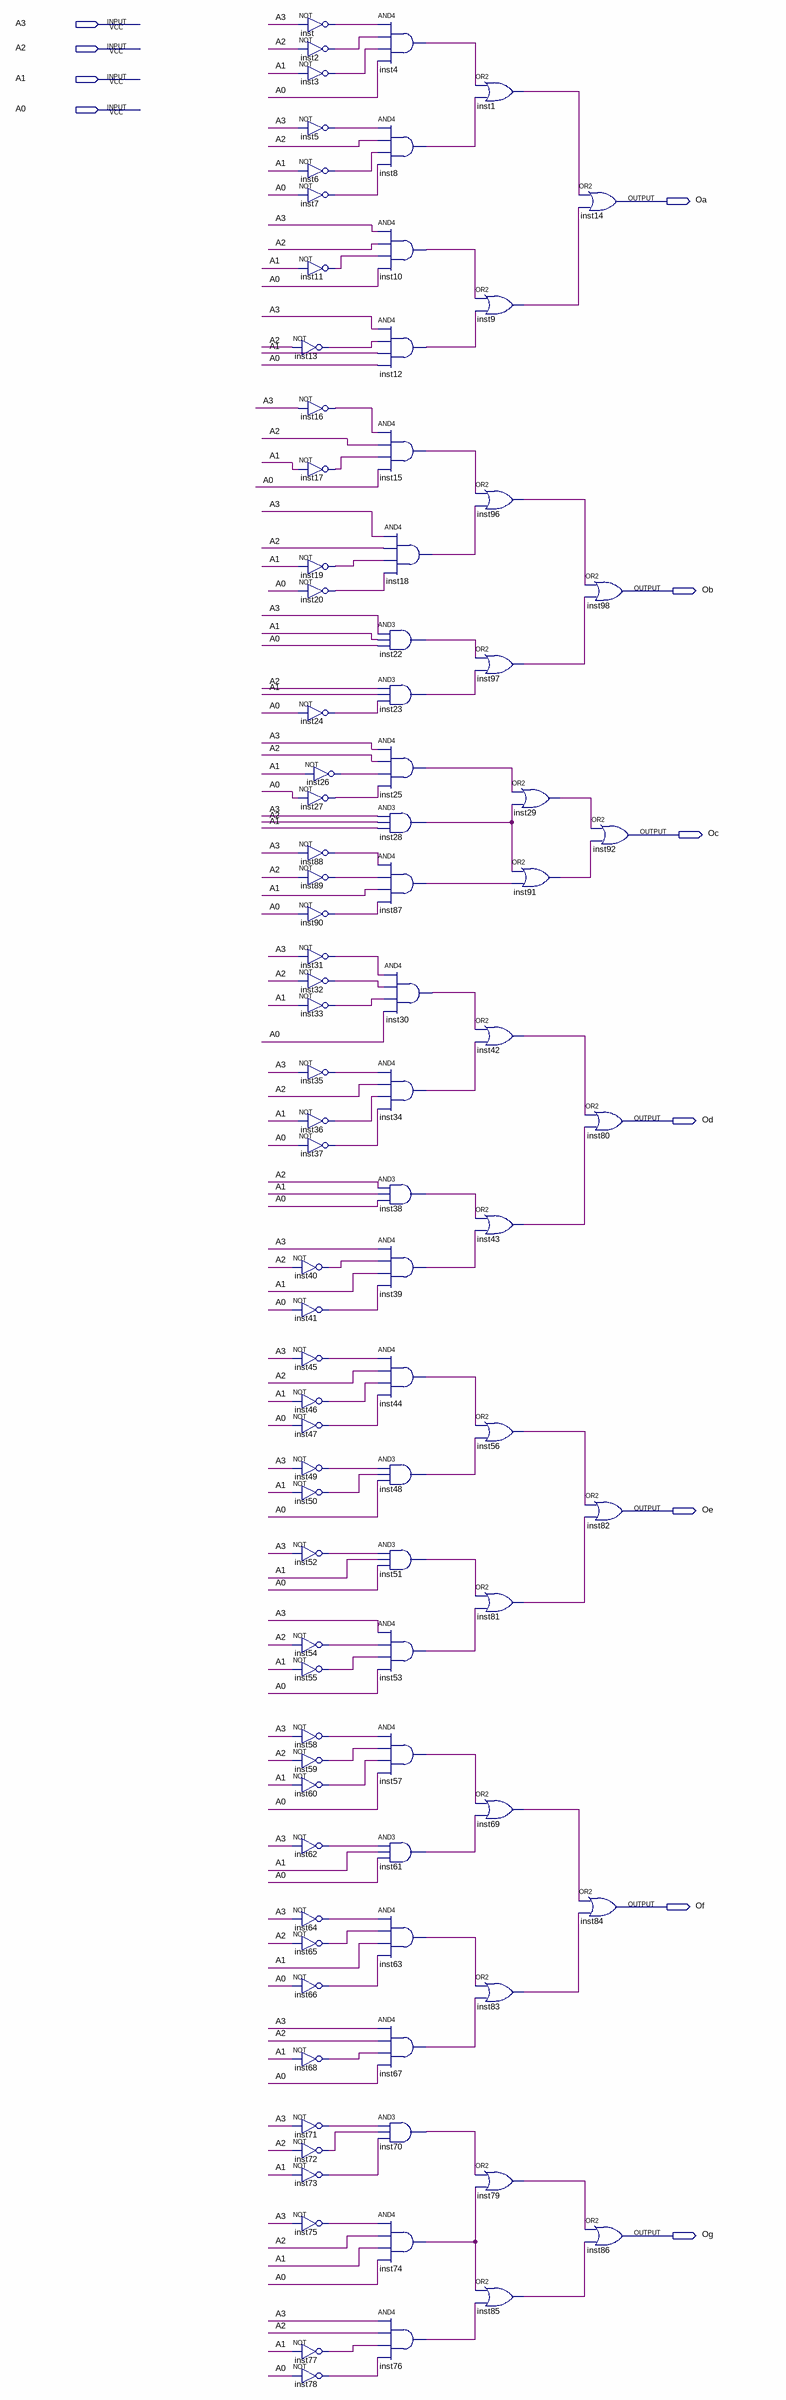
[diagram p0: schematic sheet]
// Quartus schematic SSD.bdf as structural Verilog: 95 symbols, 11 pins
module SSD (
  input  A3,
  input  A2,
  input  A1,
  input  A0,
  output Oa,
  output Ob,
  output Oc,
  output Od,
  output Oe,
  output Of,
  output Og
);

  wire inst1_out, inst2_out, inst3_out, inst4_out, inst5_out, inst6_out, inst7_out, inst8_out, inst9_out,
       inst10_out, inst11_out, inst12_out, inst13_out, inst15_out, inst16_out, inst17_out, inst18_out,
       inst19_out, inst20_out, inst22_out, inst23_out, inst24_out, inst25_out, inst26_out, inst27_out,
       inst28_out, inst29_out, inst30_out, inst31_out, inst32_out, inst33_out, inst34_out, inst35_out,
       inst36_out, inst37_out, inst38_out, inst39_out, inst40_out, inst41_out, inst42_out, inst43_out,
       inst44_out, inst45_out, inst46_out, inst47_out, inst48_out, inst49_out, inst50_out, inst51_out,
       inst52_out, inst53_out, inst54_out, inst55_out, inst56_out, inst57_out, inst58_out, inst59_out,
       inst60_out, inst61_out, inst62_out, inst63_out, inst64_out, inst65_out, inst66_out, inst67_out,
       inst68_out, inst69_out, inst70_out, inst71_out, inst72_out, inst73_out, inst74_out, inst75_out,
       inst76_out, inst77_out, inst78_out, inst79_out, inst81_out, inst83_out, inst85_out, inst87_out,
       inst88_out, inst89_out, inst90_out, inst91_out, inst96_out, inst97_out, inst_out;

  not inst (inst_out, A3);
  not inst2 (inst2_out, A2);
  not inst3 (inst3_out, A1);
  not inst5 (inst5_out, A3);
  not inst6 (inst6_out, A1);
  not inst7 (inst7_out, A0);
  not inst11 (inst11_out, A1);
  not inst13 (inst13_out, A2);
  not inst16 (inst16_out, A3);
  not inst17 (inst17_out, A1);
  not inst19 (inst19_out, A1);
  not inst20 (inst20_out, A0);
  not inst24 (inst24_out, A0);
  not inst26 (inst26_out, A1);
  not inst27 (inst27_out, A0);
  not inst88 (inst88_out, A3);
  not inst89 (inst89_out, A2);
  not inst90 (inst90_out, A0);
  not inst31 (inst31_out, A3);
  not inst32 (inst32_out, A2);
  not inst33 (inst33_out, A1);
  not inst35 (inst35_out, A3);
  not inst36 (inst36_out, A1);
  not inst37 (inst37_out, A0);
  not inst40 (inst40_out, A2);
  not inst41 (inst41_out, A0);
  not inst45 (inst45_out, A3);
  not inst46 (inst46_out, A1);
  not inst47 (inst47_out, A0);
  not inst49 (inst49_out, A3);
  not inst50 (inst50_out, A1);
  not inst52 (inst52_out, A3);
  not inst54 (inst54_out, A2);
  not inst55 (inst55_out, A1);
  not inst58 (inst58_out, A3);
  not inst59 (inst59_out, A2);
  not inst60 (inst60_out, A1);
  not inst62 (inst62_out, A3);
  not inst64 (inst64_out, A3);
  not inst65 (inst65_out, A2);
  not inst66 (inst66_out, A0);
  not inst68 (inst68_out, A1);
  not inst71 (inst71_out, A3);
  not inst72 (inst72_out, A2);
  not inst73 (inst73_out, A1);
  not inst75 (inst75_out, A3);
  not inst77 (inst77_out, A1);
  not inst78 (inst78_out, A0);
  and inst4 (inst4_out, inst_out, inst2_out, inst3_out, A0);
  and inst8 (inst8_out, inst5_out, A2, inst6_out, inst7_out);
  and inst10 (inst10_out, A3, A2, inst11_out, A0);
  and inst12 (inst12_out, A3, inst13_out, A1, A0);
  and inst15 (inst15_out, inst16_out, A2, inst17_out, A0);
  and inst22 (inst22_out, A3, A1, A0);
  and inst23 (inst23_out, A2, A1, inst24_out);
  and inst25 (inst25_out, A3, A2, inst26_out, inst27_out);
  and inst28 (inst28_out, A3, A2, A1);
  and inst87 (inst87_out, inst88_out, inst89_out, A1, inst90_out);
  and inst34 (inst34_out, inst35_out, A2, inst36_out, inst37_out);
  and inst38 (inst38_out, A2, A1, A0);
  and inst39 (inst39_out, A3, inst40_out, A1, inst41_out);
  and inst44 (inst44_out, inst45_out, A2, inst46_out, inst47_out);
  and inst48 (inst48_out, inst49_out, inst50_out, A0);
  and inst51 (inst51_out, inst52_out, A1, A0);
  and inst53 (inst53_out, A3, inst54_out, inst55_out, A0);
  and inst57 (inst57_out, inst58_out, inst59_out, inst60_out, A0);
  and inst61 (inst61_out, inst62_out, A1, A0);
  and inst63 (inst63_out, inst64_out, inst65_out, A1, inst66_out);
  and inst67 (inst67_out, A3, A2, inst68_out, A0);
  and inst70 (inst70_out, inst71_out, inst72_out, inst73_out);
  and inst74 (inst74_out, inst75_out, A2, A1, A0);
  and inst76 (inst76_out, A3, A2, inst77_out, inst78_out);
  and inst18 (inst18_out, A3, A2, inst19_out, inst20_out);
  and inst30 (inst30_out, inst31_out, inst32_out, inst33_out, A0);
  or inst1 (inst1_out, inst4_out, inst8_out);
  or inst9 (inst9_out, inst10_out, inst12_out);
  or inst96 (inst96_out, inst15_out, inst18_out);
  or inst97 (inst97_out, inst22_out, inst23_out);
  or inst42 (inst42_out, inst30_out, inst34_out);
  or inst43 (inst43_out, inst38_out, inst39_out);
  or inst56 (inst56_out, inst44_out, inst48_out);
  or inst81 (inst81_out, inst51_out, inst53_out);
  or inst69 (inst69_out, inst57_out, inst61_out);
  or inst83 (inst83_out, inst63_out, inst67_out);
  or inst79 (inst79_out, inst70_out, inst74_out);
  or inst85 (inst85_out, inst74_out, inst76_out);
  or inst29 (inst29_out, inst25_out, inst28_out);
  or inst91 (inst91_out, inst28_out, inst87_out);
  or inst14 (Oa, inst1_out, inst9_out);
  or inst98 (Ob, inst96_out, inst97_out);
  or inst92 (Oc, inst29_out, inst91_out);
  or inst80 (Od, inst42_out, inst43_out);
  or inst82 (Oe, inst56_out, inst81_out);
  or inst84 (Of, inst69_out, inst83_out);
  or inst86 (Og, inst79_out, inst85_out);
endmodule
